# Altium project MAM17.PrjPCB
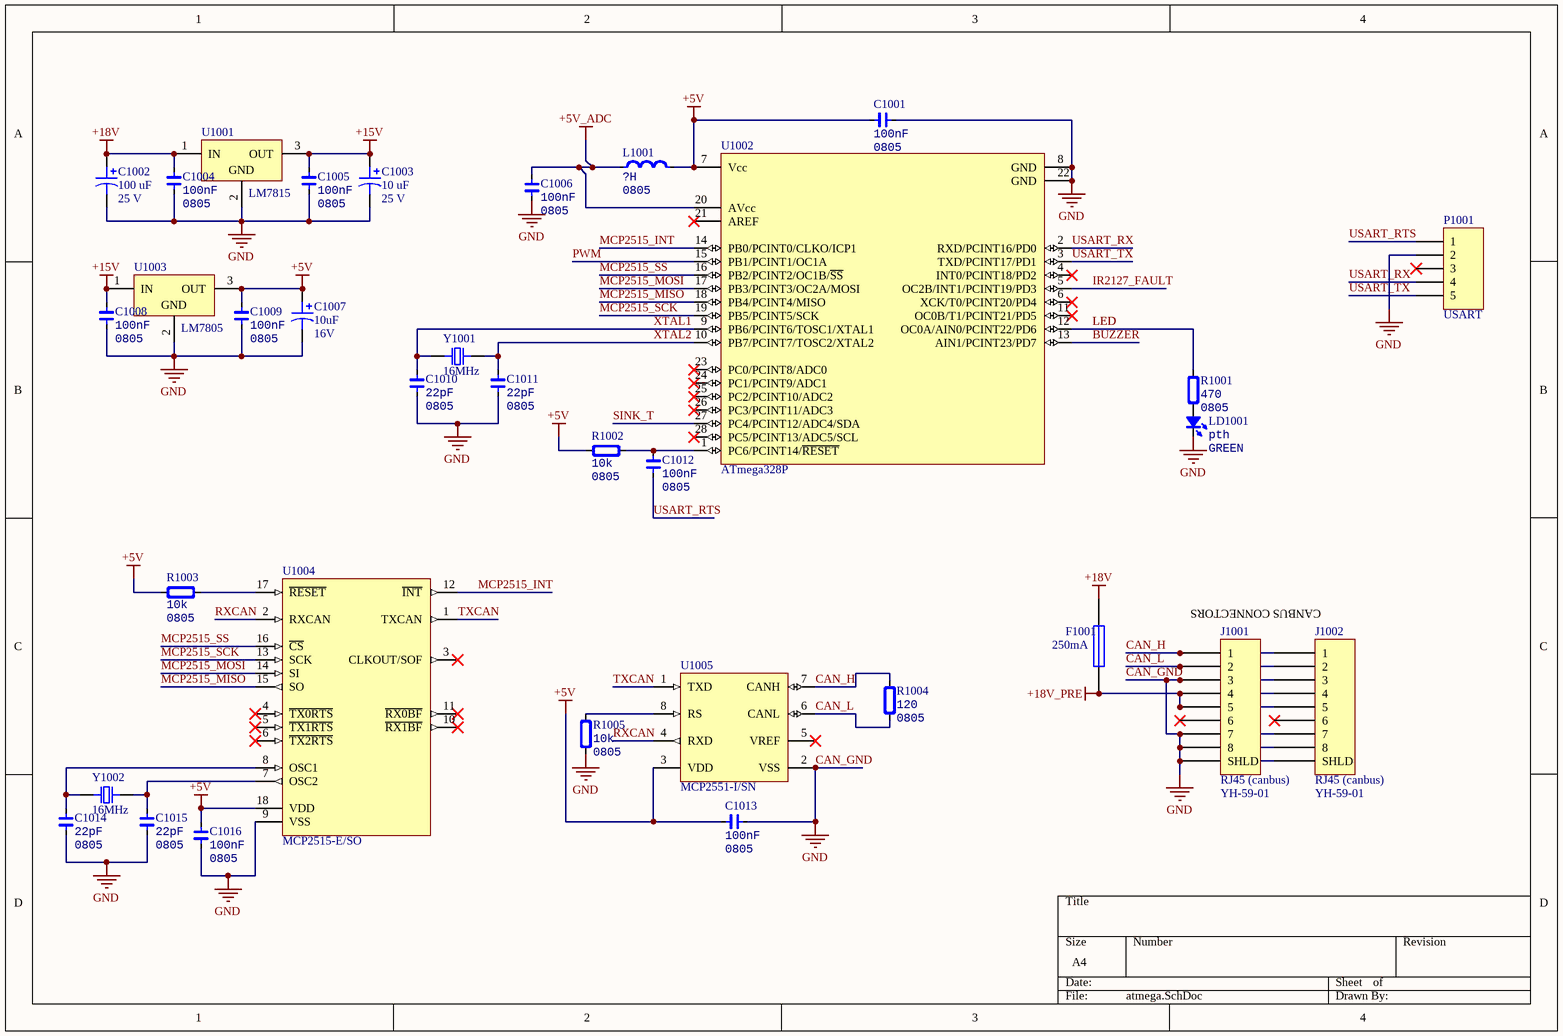
[diagram p0: atmega.SchDoc]
3 sheets, 75 parts. Net scope: global (net labels, ports and power ports of the same name join across sheets).
Board file: MAM17_driver_correction.PcbDoc
Sheets:
  atmega.SchDoc
  driver.SchDoc
  chopper.SchDoc

## Sheet atmega.SchDoc
size A4

### Parts
(Parts that share a designator on the sheet are numbered #1, #2 ... from top to bottom, then left to right.)
C1001  Type: 0805  [0805C]  (hidden comment: 100nF)
C1002  value 100 uF  Voltage: 25 V  [CP3.5mm-8.0mm]  (hidden comment: CapacitorPol)
C1003  value 10 uF  Voltage: 25 V  [CP3.5mm-8.0mm]  (hidden comment: CapacitorPol)
C1004  Type: 0805  [0805C]  (hidden comment: 100nF)
C1005  Type: 0805  [0805C]  (hidden comment: 100nF)
C1006  Type: 0805  [0805C]  (hidden comment: 100nF)
C1007  value 10uF  Voltage: 16V  [CP3.5mm-8.0mm]  (hidden comment: CapacitorPol)
C1008  Type: 0805  [0805C]  (hidden comment: 100nF)
C1009#1  Type: 0805  [0805C]  (hidden comment: 100nF)
C1010  Type: 0805  [0805C]  (hidden comment: 22pF)
C1011  Type: 0805  [0805C]  (hidden comment: 22pF)
C1012  Type: 0805  [0805C]  (hidden comment: 100nF)
C1013  Type: 0805  [0805C]  (hidden comment: 100nF)
C1014  Type: 0805  [0805C]  (hidden comment: 22pF)
C1015  Type: 0805  [0805C]  (hidden comment: 22pF)
C1016  Type: 0805  [0805C]  (hidden comment: 100nF)
F1001  250mA  [Porta Fusivel]
J1001  RJ45 (canbus)  value YH-59-01  [ASSMANN A-2004-2-4-LP/FS]
J1002  RJ45 (canbus)  value YH-59-01  [ASSMANN A-2004-2-4-LP/FS]
L1001  Type: 0805  [0805L]  (hidden comment: ?H)
LD1001  Type: pth  [LED3MM]  (hidden comment: GREEN)
P1001  USART  [HDR1X5]
R1001  Type: 0805  [0805R]  (hidden comment: 470)
R1002  Type: 0805  [0805R]  (hidden comment: 10k)
R1003  Type: 0805  [0805R]  (hidden comment: 10k)
R1004  Type: 0805  [0805R]  (hidden comment: 120)
R1005  Type: 0805  [0805R]  (hidden comment: 10k)
U1001  LM7815  [TO220_deitado]
U1002  ATmega328P  [DIP28-300(100)]
U1003  LM7805  [TO220_deitado]
U1004  MCP2515-E/SO  [WSO18_L]
U1005  MCP2551-I/SN  [SOIC08-150(50)]
Y1001  16MHz  [HC49-US-THT]
Y1002  16MHz  [HC49-US-THT]

### Nets
+5V: C1001.1 C1007.1 C1009#1.2 C1013.1 C1016.1 L1001.2 R1002.1 R1003.1 U1002.7(Vcc) U1003.3(OUT) U1004.18(VDD) U1005.3(VDD)
+5V_ADC: C1006.2 L1001.1 U1002.20(AVcc)
+15V: C1003.1 C1005.2 C1008.2 U1001.3(OUT) U1003.1(IN)
+18V: C1002.1 C1004.2 F1001.1 U1001.1(IN)
+18V_PRE: F1001.2 J1001.4 J1001.5 J1002.4 J1002.5
CAN_GND: C1001.2 C1002.2 C1003.2 C1004.1 C1005.1 C1006.1 C1007.2 C1008.1 C1009#1.1 C1010.1 C1011.1 C1013.2 C1014.1 C1015.1 C1016.2 J1001.3 J1001.7 J1001.8 J1001.S(SHLD) J1002.3 J1002.7 J1002.8 J1002.S(SHLD) LD1001.2(K) P1001.2 R1005.2 U1001.2(GND) U1002.8(GND) U1002.22(GND) U1003.2(GND) U1004.9(VSS) U1005.2(VSS)  [also labelled GND]
BUZZER: U1002.13(AIN1/PCINT23/PD7)
CAN_H: J1001.1 J1002.1 R1004.2 U1005.7(CANH)
CAN_L: J1001.2 J1002.2 R1004.1 U1005.6(CANL)
IR2127_FAULT: U1002.5(OC2B/INT1/PCINT19/PD3)
LED: R1001.2 U1002.12(OC0A/AIN0/PCINT22/PD6)
MCP2515_INT: U1002.14(PB0/PCINT0/CLKO/ICP1) U1004.12(~{INT})
MCP2515_MISO: U1002.18(PB4/PCINT4/MISO) U1004.15(SO)
MCP2515_MOSI: U1002.17(PB3/PCINT3/OC2A/MOSI) U1004.14(SI)
MCP2515_SCK: U1002.19(PB5/PCINT5/SCK) U1004.13(SCK)
MCP2515_SS: U1002.16(PB2/PCINT2/OC1B/~{SS}) U1004.16(~{CS})
PWM: U1002.15(PB1/PCINT1/OC1A)
RXCAN: U1004.2(RXCAN) U1005.4(RXD)
SINK_T: U1002.27(PC4/PCINT12/ADC4/SDA)
TXCAN: U1004.1(TXCAN) U1005.1(TXD)
USART_RTS: C1012.2 P1001.1
USART_RX: P1001.4 U1002.2(RXD/PCINT16/PD0)
USART_TX: P1001.5 U1002.3(TXD/PCINT17/PD1)
XTAL1: C1010.2 U1002.9(PB6/PCINT6/TOSC1/XTAL1) Y1001.1
XTAL2: C1011.2 U1002.10(PB7/PCINT7/TOSC2/XTAL2) Y1001.2
NetC1012_1: C1012.1 R1002.2 U1002.1(PC6/PCINT14/~{RESET})
NetC1014_2: C1014.2 U1004.8(OSC1) Y1002.1
NetC1015_2: C1015.2 U1004.7(OSC2) Y1002.2
NetLD1001_1: LD1001.1(A) R1001.1
NetR1003_2: R1003.2 U1004.17(~{RESET})
NetR1005_1: R1005.1 U1005.8(RS)

Not connected (* = marked no-connect by the designer): J1001 6*; J1002 6*; P1001 3*; U1002 4(INT0/PCINT18/PD2)* 6(XCK/T0/PCINT20/PD4)* 11(OC0B/T1/PCINT21/PD5)* 21(AREF)* 23(PC0/PCINT8/ADC0)* 24(PC1/PCINT9/ADC1)* 25(PC2/PCINT10/ADC2)* 26(PC3/PCINT11/ADC3)* 28(PC5/PCINT13/ADC5/SCL)*; U1004 3(CLKOUT/SOF)* 4(~{TX0RTS})* 5(~{TX1RTS})* 6(~{TX2RTS})* 10(~{RX1BF})* 11(~{RX0BF})*; U1005 5(VREF)*

### Notes on the sheet
- CANBUS CONNECTORS

### Library data of the parts
C1001 C1004-C1006 C1008 C1009#1 C1010-C1016 = Cap_0805: Capacitor
  C1001 C1004-C1006 C1008 C1009#1 C1012 C1013 C1016: Value: 100nF
  C1010 C1011 C1014 C1015: Value: 22pF
C1002 C1003 C1007 = CapacitorPol: Solid Aluminum Capacitor with Organic Semiconductor Electrolyte: 100uF, 10V, Bulk Pack; PackageReference: E
F1001 = Fuse 1: Fuse; LatestRevisionNote: Re-released for DXP Platform.; PackageReference: PIN-W2/E2.8
J1001 J1002 = Modular Jack with Shield: YH-59-01
L1001 = Ind_0805: Inductor; Value: ?H
LD1001 = LED_0805: LED; Value: GREEN
P1001 = Header 5: Header, 5-Pin; LatestRevisionNote: Re-released for DXP Platform.
R1001-R1005 = Res_0805: Resistor
  R1001: Value: 470
  R1002 R1003 R1005: Value: 10k
  R1004: Value: 120
U1001 U1003 = µA7805CKC: Positive-Voltage Regulator; PackageReference: KC03
U1002 = ATmega328P: 8-bit AVR Microcontroller, 32KB Flash, 1KB EEPROM, 2KB SRAM, 28-pin PDIP, Industrial Grade (-40°C to 85°C); PackageReference: 28P3
U1004 = CMP-0186-00035-2: Stand-Alone CAN Controller With SPI Interface, 18-Pin SOIC, Extended Temperature; PackageReference: SOIC-SO18
U1005 = CMP-1721-00003-1: High-Speed CAN Transceiver, / 1 Mb/s, 4.5 to 5.5 V, 8-Pin SOIC (SN), Industrial Temperature, RoHS, Tube; PackageReference: SN8
Y1001 Y1002 = Crystal

## Sheet driver.SchDoc
size A4
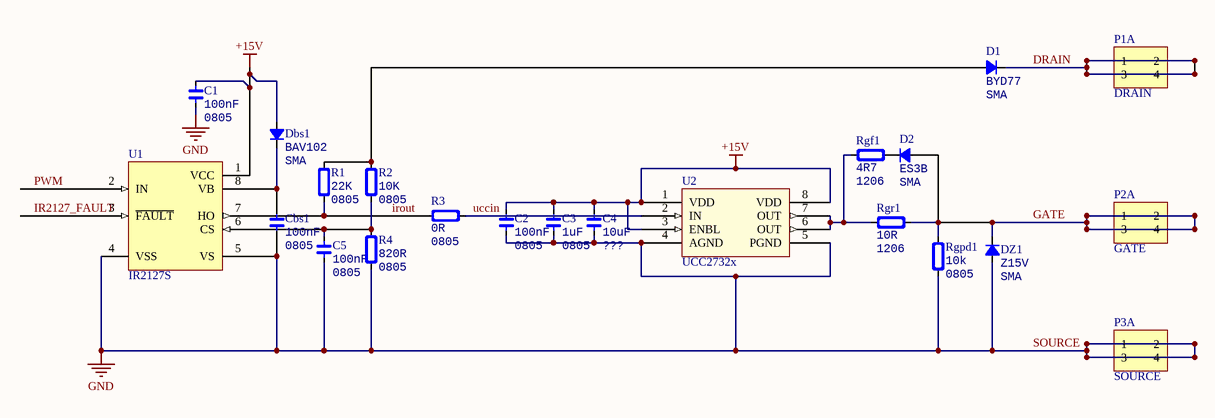
[diagram p1: driver.SchDoc]

### Parts
C1  Type: 0805  [0805C]  (hidden comment: 100nF)
C2  Type: 0805  [0805C]  (hidden comment: 100nF)
C3  Type: 0805  [0805C]  (hidden comment: 1uF)
C4  Type: ???  [0805C]  (hidden comment: 10uF)
C5  Type: 0805  [0805C]  (hidden comment: 100nF)
Cbs1  Type: 0805  [0805C]  (hidden comment: 100nF)
D1  Type: SMA  [DSO-C2/X2.3]  (hidden comment: BYD77)
D2  Type: SMA  [DSO-C2/X2.3]  (hidden comment: ES3B)
Dbs1  Type: SMA  [DSO-C2/X2.3]  (hidden comment: BAV102)
DZ1  Type: SMA  [DSO-C2/X2.3]  (hidden comment: Z15V)
P1A  DRAIN  [HDR2X2]
P2A  GATE  [HDR2X2]
P3A  SOURCE  [HDR2X2]
R1  Type: 0805  [0805R]  (hidden comment: 22K)
R2  Type: 0805  [0805R]  (hidden comment: 10K)
R3  Type: 0805  [0805R]  (hidden comment: 0R)
R4  Type: 0805  [0805R]  (hidden comment: 820R)
Rgf1  Type: 1206  [RESC3225L]  (hidden comment: 4R7)
Rgpd1  Type: 0805  [0805R]  (hidden comment: 10k)
Rgr1  Type: 1206  [RESC3225L]  (hidden comment: 10R)
U1  IR2127S  [SOIC08-150(50)]
U2  UCC2732x  [SOIC08-Thermal]

### Nets
+15V: C1.1 C2.1 C3.1 C4.1 Dbs1.1(A) U1.1(VCC) U2.1(VDD) U2.3(ENBL) U2.8(VDD)
GND: C1.2 C2.2 C3.2 C4.2 C5.2 Cbs1.2 DZ1.1(A) P3A.1 P3A.2 P3A.3 P3A.4 R4.2 Rgpd1.2 U1.4(VSS) U1.5(VS) U2.4(AGND) U2.5(PGND)  [also labelled SOURCE]  [project net CAN_GND]
DRAIN: D1.2(K) P1A.1 P1A.2 P1A.3 P1A.4
GATE: D2.1(A) DZ1.2(K) P2A.1 P2A.2 P2A.3 P2A.4 Rgpd1.1 Rgr1.1
IR2127_FAULT: U1.3(~{FAULT})
irout: R1.2 R3.2 U1.7(HO)
PWM: U1.2(IN)
uccin: R3.1 U2.2(IN)
NetC5_1: C5.1 R2.2 R4.1 U1.6(CS)
NetCbs1_1: Cbs1.1 Dbs1.2(K) U1.8(VB)
NetD1_1: D1.1(A) R1.1 R2.1
NetD2_2: D2.2(K) Rgf1.1
NetRgf1_2: Rgf1.2 Rgr1.2 U2.6(OUT) U2.7(OUT)

### Library data of the parts
C1-C5 Cbs1 = Cap_0805: Capacitor
  C1 C2 C5 Cbs1: Value: 100nF
  C3: Value: 1uF
  C4: Value: 10uF
D1 D2 Dbs1 DZ1 = Diode_SMA: Diode
  D1: Value: BYD77
  D2: Value: ES3B
  Dbs1: Value: BAV102
  DZ1: Value: Z15V
P1A P2A P3A = Header 2X2: Header, 2-Pin, Dual row; LatestRevisionDate: 17-Jul-2002; LatestRevisionNote: Re-released for DXP Platform.; Publisher: Altium Limited
R1-R4 Rgf1 Rgpd1 Rgr1 = Res_0805: Resistor
  R1: Value: 22K
  R2: Value: 10K
  R3: Value: 0R
  R4: Value: 820R
  Rgf1: Value: 4R7
  Rgpd1: Value: 10k
  Rgr1: Value: 10R
U1 = IR2127S: Current Sensing Single Channel Driver; Published: 8-Jun-2000; LatestRevisionDate: 13-Apr-2006; LatestRevisionNote: IPC-7351 Footprint Added.; DatasheetVersion: PD60143J; PackageVersion: Feb-2001; PackageReference: SO-8; Publisher: Altium Limited; PackageDescription: 8-Pin Plastic Small Outline Integrated Circuit 1.27 mm Pitch; Code_JEDEC: MS-012-AA; Code_IPC: SOIC127P600-8; ComponentLink1Description: Manufacturer Link; ComponentLink1URL: http://www.irf.com/; ComponentLink2Description: Datasheet; ComponentLink2URL: http://www.irf.com/product-info/datasheets/data/ir2127.pdf; value: IR2127S

## Sheet chopper.SchDoc
size A
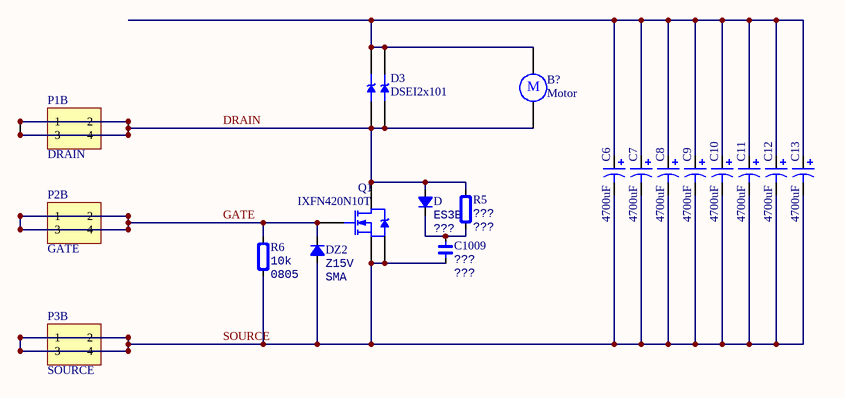
[diagram p2: chopper.SchDoc]

### Parts
(Parts that share a designator on the sheet are numbered #1, #2 ... from top to bottom, then left to right.)
B?  Motor  (graphical)
C6  value 4700uF  (graphical)
C7  value 4700uF  (graphical)
C8  value 4700uF  (graphical)
C9  value 4700uF  (graphical)
C10  value 4700uF  (graphical)
C11  value 4700uF  (graphical)
C12  value 4700uF  (graphical)
C13  value 4700uF  (graphical)
C1009#2  ???
D  Type: ???  [DSO-C2/X2.3]  (hidden comment: ES3B)
D3  DSEI2x101  [SOT-227B]
DZ2  Type: SMA  [DSO-C2/X2.3]  (hidden comment: Z15V)
P1B  DRAIN  [HDR2X2]
P2B  GATE  [HDR2X2]
P3B  SOURCE  [HDR2X2]
Q1  IXFN420N10T  [SOT-227B]
R5  ???  [0805R]
R6  Type: 0805  [0805R]  (hidden comment: 10k)

### Nets
SOURCE: C6.2 C7.2 C8.2 C9.2 C10.2 C11.2 C12.2 C13.2 C1009#2.1 DZ2.1(A) P3B.1 P3B.2 P3B.3 P3B.4 Q1.1(S) Q1.4(S) R6.2  [project net CAN_GND]
DRAIN: B?.2 D.1(A) D3.2(A1) D3.3(A2) P1B.1 P1B.2 P1B.3 P1B.4 Q1.3(D) R5.1
GATE: DZ2.2(K) P2B.1 P2B.2 P2B.3 P2B.4 Q1.2(G) R6.1
NetB?_1: B?.1 C6.1 C7.1 C8.1 C9.1 C10.1 C11.1 C12.1 C13.1 D3.1(K1) D3.4(K2)
NetC1009#2_2: C1009#2.2 D.2(K) R5.2

### Notes on the sheet
- (in symbol Motor) M

### Library data of the parts
B? = Motor: Motor, General Kind
C6-C13 = Cap Pol1: Polarized Capacitor (Radial)
C1009#2 = Cap_0805: Capacitor; Value: ???; Type: ???
D DZ2 = Diode_SMA: Diode
  D: Value: ES3B
  DZ2: Value: Z15V
P1B P2B P3B = Header 2X2: Header, 2-Pin, Dual row; LatestRevisionDate: 17-Jul-2002; LatestRevisionNote: Re-released for DXP Platform.; Publisher: Altium Limited
R5 R6 = Res_0805: Resistor
  R5: Value: ???; Type: ???
  R6: Value: 10k

## Nets that join several sheets
+15V: atmega (5 pins), driver (9 pins)
CAN_GND: atmega (32 pins), driver (17 pins), chopper (17 pins)
DRAIN: driver (5 pins), chopper (10 pins)
GATE: driver (8 pins), chopper (7 pins)
IR2127_FAULT: atmega (U1002.5), driver (U1.3)
PWM: atmega (U1002.15), driver (U1.2)